# EasyEDA Pro project ProPrj_HydroNodeStation01_2026-04-19.epro, schematic Schematic1
Board Name: STM32; Create Date: 2026-04-07; Page Name: P1; Project Name: HydroNodeStation01; Schematic Name: Schematic1; Update Date: 2026-04-13; Company: EasyEDA.com; Page Size: A4; Version: V1.0
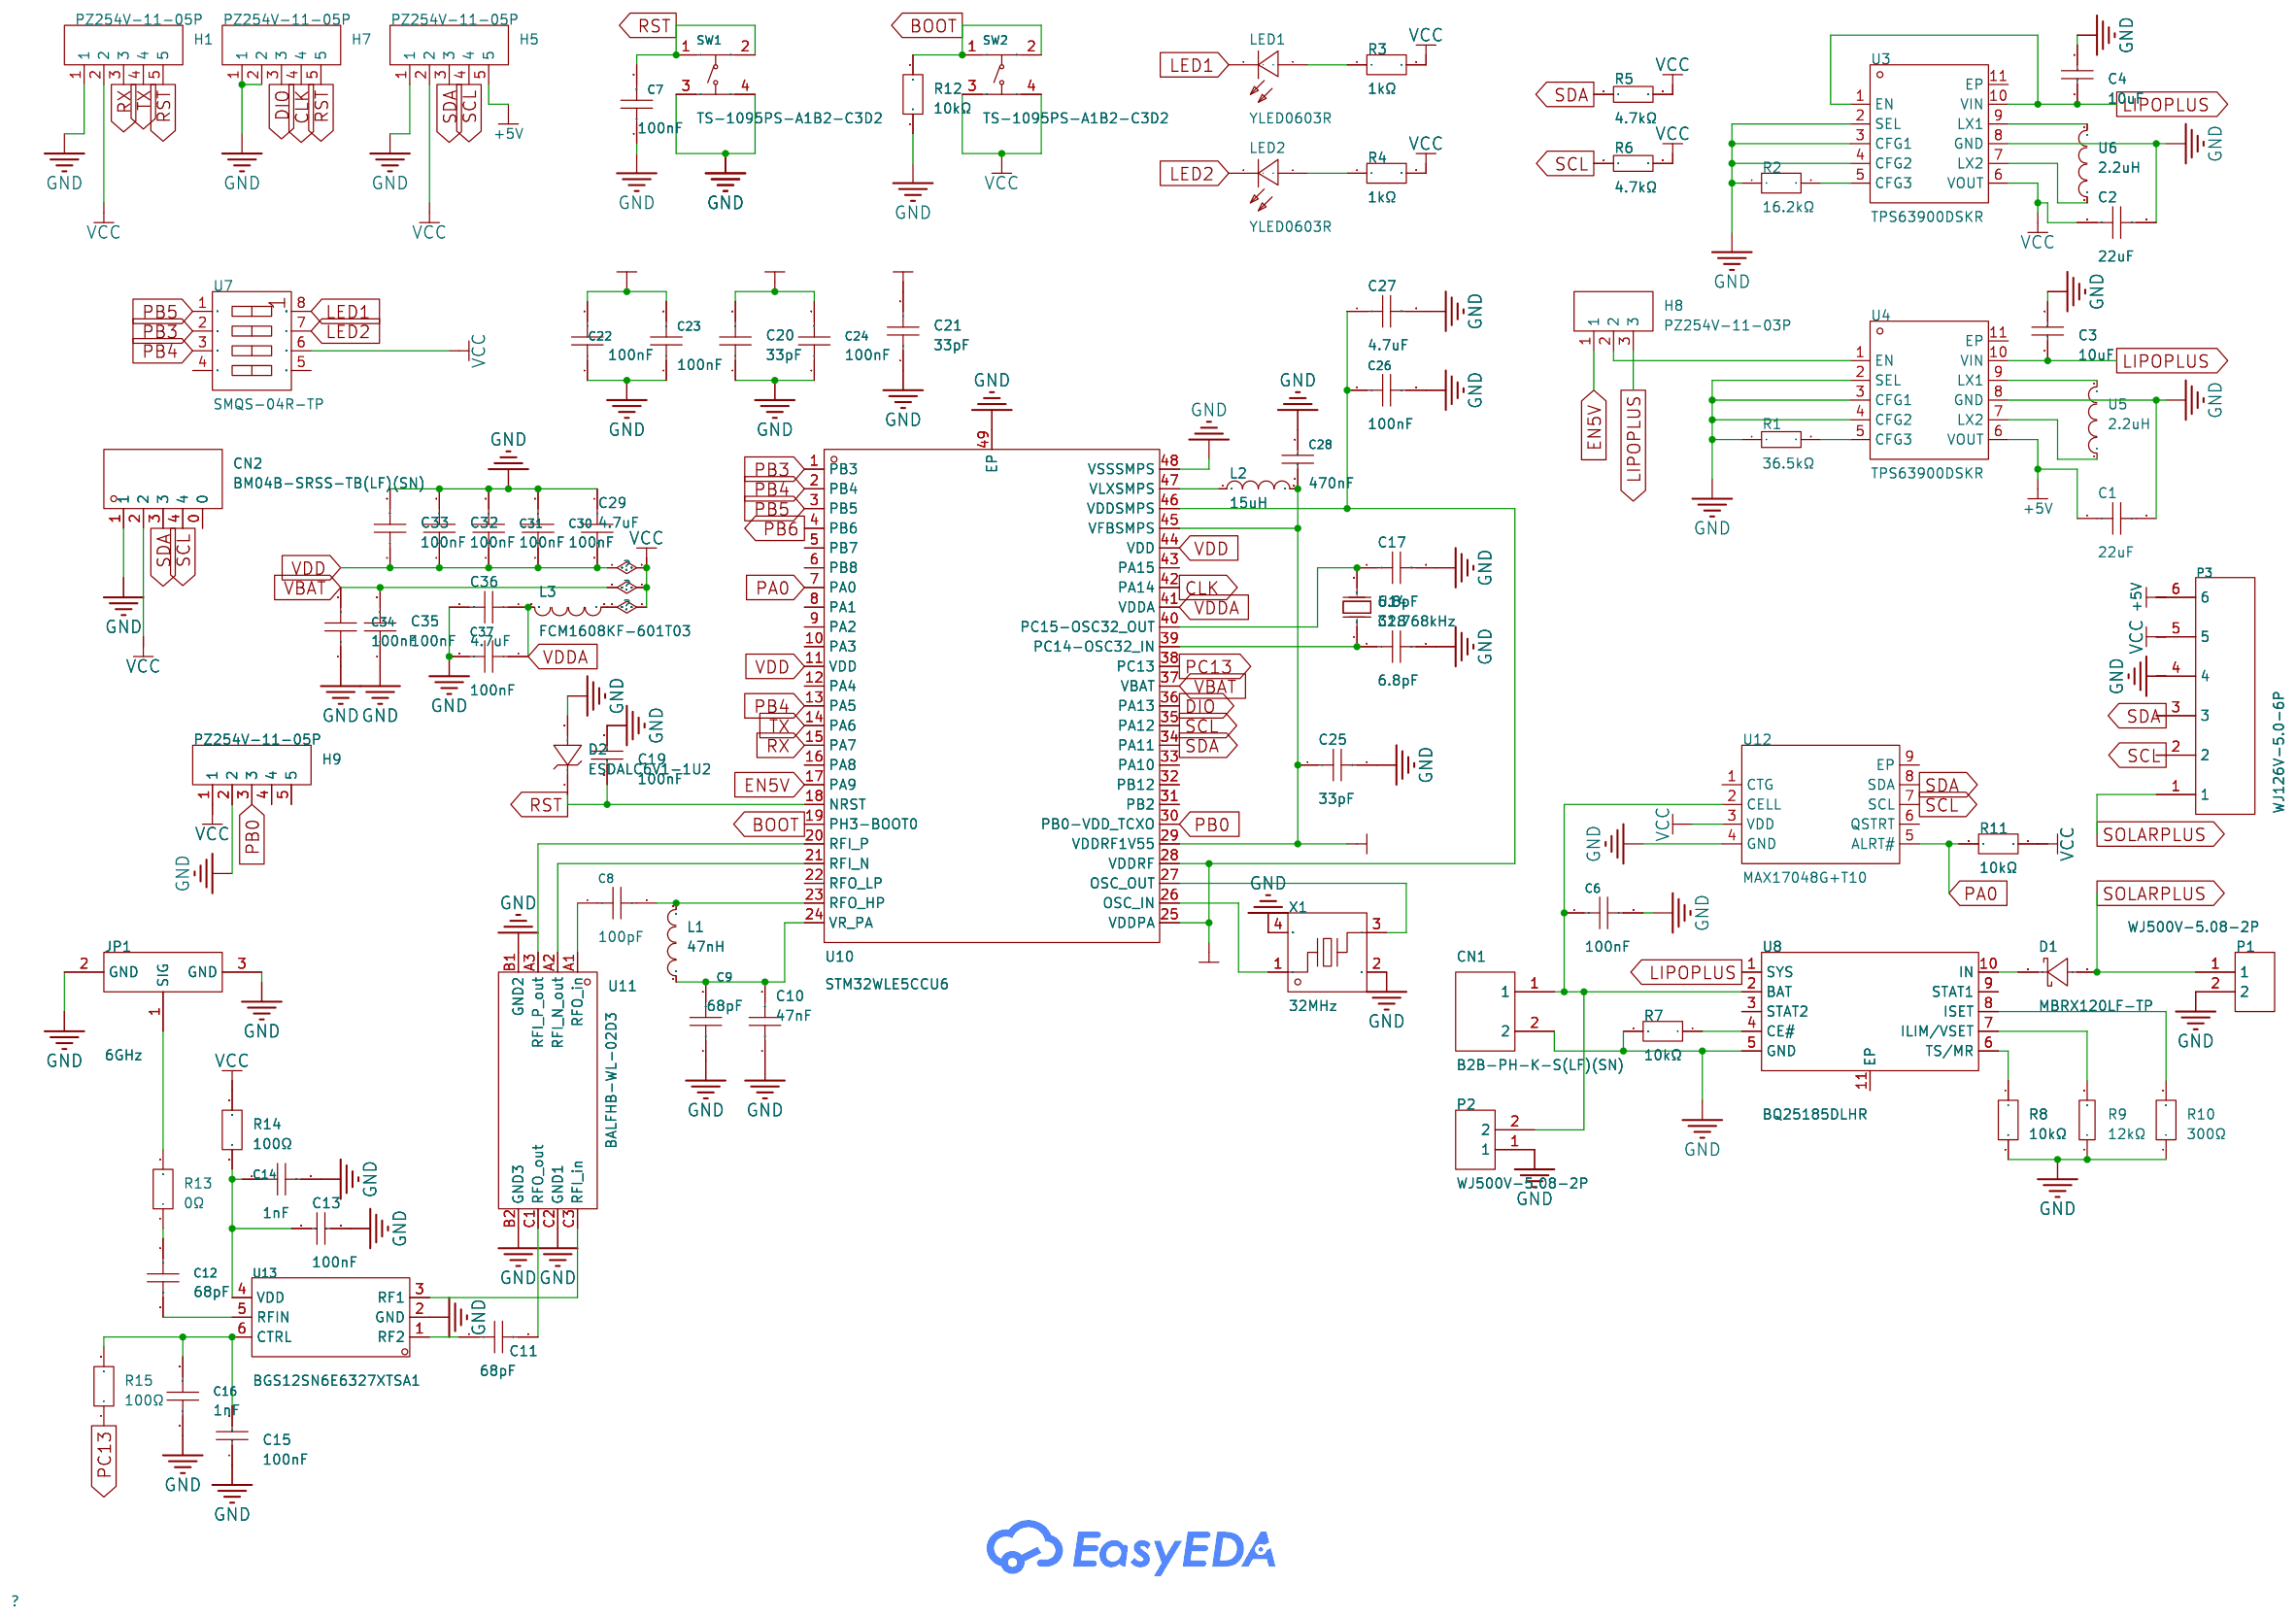
[diagram p0: schematic sheet]

## Parts
C1  22uF  [C0603]
C2  22uF  [C0603]
C3  10uF  [C0402]
C4  10uF  [C0402]
C6  100nF  [C0402]
C7  100nF  [C0402]
C8  100pF  [C0603]
C9  68pF  [C0402]
C10  47nF  [C0402]
C11  68pF  [C0201]
C12  68pF  [C0402]
C13  100nF  [C0201]
C14  1nF  [C0201]
C15  100nF  [C0201]
C16  1nF  [C0201]
C17  6.8pF  [C0402]
C18  6.8pF  [C0402]
C19  100nF  [C0201]
C20  33pF  [C0201]
C21  33pF  [C0201]
C22  100nF  [C0402]
C23  100nF  [C0402]
C24  100nF  [C0402]
C25  33pF  [C0201]
C26  100nF  [C0402]
C27  4.7uF  [C0603]
C28  470nF  [C0603]
C29  4.7uF  [C0603]
C30  100nF  [C0402]
C31  100nF  [C0402]
C32  100nF  [C0201]
C33  100nF  [C0201]
C34  100nF  [C0402]
C35  100nF  [C0201]
C36  4.7uF  [C0603]
C37  100nF  [C0402]
CN1  B2B-PH-K-S(LF)(SN)  [CONN-TH_B2B-PH-K-S]
CN2  BM04B-SRSS-TB(LF)(SN)  [CONN-SMD_BM04B-SRSS-TB]
D1  MBRX120LF-TP  [SOD-123_L2.7-W1.6-LS3.7-RD]
D2  ESDALC6V1-1U2  [DFN0603-D_L0.6-W0.3-P0.34-RD]
H1  PZ254V-11-05P  [HDR-TH_5P-P2.54-V-M]
H5  PZ254V-11-05P  [HDR-TH_5P-P2.54-V-M]
H7  PZ254V-11-05P  [HDR-TH_5P-P2.54-V-M]
H8  PZ254V-11-03P  [HDR-TH_3P-P2.54-V-M_PZ254V-11-03P]
H9  PZ254V-11-05P  [HDR-TH_5P-P2.54-V-M]
JP1  6GHz  [RF-SMD_FRF05002-JSS103M]
L1  47nH  [L0402]
L2  15uH  [L0805]
L3  FCM1608KF-601T03  [L0603]
LED1  YLED0603R  [LED0603-FD]
LED2  YLED0603R  [LED0603-FD]
P1  WJ500V-5.08-2P  [CONN-TH_2P-P5.00_WJ500V-5.08-2P]
P2  WJ500V-5.08-2P  [CONN-TH_2P-P5.00_WJ500V-5.08-2P]
P3  WJ126V-5.0-6P  [CONN-TH_6P-P5.00_WJ126V-5.0-6P]
R1  36.5kΩ  [R0402]
R2  16.2kΩ  [R0402]
R3  1kΩ  [R0402]
R4  1kΩ  [R0402]
R5  4.7kΩ  [R0603]
R6  4.7kΩ  [R0603]
R7  10kΩ  [R0805]
R8  10kΩ  [R0805]
R9  12kΩ  [R0402]
R10  300Ω  [R0603]
R11  10kΩ  [R0805]
R12  10kΩ  [R0805]
R13  0Ω  [R0201]
R14  100Ω  [R0201]
R15  100Ω  [R0201]
SW1  TS-1095PS-A1B2-C3D2  [KEY-SMD_4P-L6.0-W6.0-P3.90-LS9.0]
SW2  TS-1095PS-A1B2-C3D2  [KEY-SMD_4P-L6.0-W6.0-P3.90-LS9.0]
U3  TPS63900DSKR  [WSON-10_L2.5-W2.5-W0.50-TL-EP]
U4  TPS63900DSKR  [WSON-10_L2.5-W2.5-W0.50-TL-EP]
U5  2.2uH  [IND-SMD_L3.0-W3.0_LVF303012-4R7M-N]
U6  2.2uH  [IND-SMD_L3.0-W3.0_LVF303012-4R7M-N]
U7  SMQS-04R-TP  [SW-TH_8P-P2.54_SMQS-04R-TP]
U8  BQ25185DLHR  [WSON-10_L2.2-W2.0-P0.40-BL-EP_TI_DLH0010A]
U10  STM32WLE5CCU6  [UFQFPN-48_L7.0-W7.0-P0.50-BL-EP5.6]
U11  BALFHB-WL-02D3  [CSPG-8_L2.1-W1.8_BALFHB-WL-03D3]
U12  MAX17048G+T10  [TDFN-8_L2.0-W2.0-P0.50-BL-EP1.2]
U13  BGS12SN6E6327XTSA1  [TSNP-6_L1.1-W0.7-P0.40-BL]
U14  32.768kHz  [CRYSTAL-SMD_L2.0-W1.2]
X1  32MHz  [CRYSTAL-SMD_4P-L2.0-W1.6-BL]

## Library data of the parts
C1 C2 = CL10A226MQ8NRNC: Capacitance:22uF Tolerance:±20% Tolerance:±20% Voltage Rating:6.3V Temperature Coefficient:X5R; LCSC Part Name: 22uF ±20% 6.3V; Supplier Part: C59461; Manufacturer: SAMSUNG(三星); Supplier Footprint: 0603; JLCPCB Part Class: Basic Part; Datasheet: https://item.szlcsc.com/datasheet/CL10A226MQ8NRNC/60514.html; Supplier: LCSC; Tolerance: ±20%; Voltage Rating: 6.3V; Temperature Coefficient: X5R
C3 C4 = CL05A106MQ5NUNC: Capacitance:10uF Tolerance:±20% Tolerance:±20% Voltage Rating:6.3V Temperature Coefficient:X5R; LCSC Part Name: 10uF ±20% 6.3V; Supplier Part: C15525; Manufacturer: SAMSUNG(三星); Supplier Footprint: 0402; JLCPCB Part Class: Basic Part; Datasheet: https://item.szlcsc.com/datasheet/CL05A106MQ5NUNC/16204.html; Supplier: LCSC; Tolerance: ±20%; Voltage Rating: 6.3V; Temperature Coefficient: X5R
C6 C7 C22-C24 C26 C30 C31 C34 C37 = CC0402KRX7R7BB104: Capacitance: Tolerance:±10% Tolerance:±10% Voltage Rated: Temperature Coefficient:; LCSC Part Name: 100nF ±10% 16V; Supplier Part: C60474; Manufacturer: YAGEO(国巨); Supplier Footprint: 0402; JLCPCB Part Class: Extended Part; Datasheet: https://atta.szlcsc.com/upload/public/pdf/source/20211223/9278FD768280B81DDBEF48FA36411A03.pdf; Supplier: LCSC; Tolerance: ±10%
C8 = CC0603JRNPO9BN101: Capacitance:100pF Tolerance:±5% Tolerance:±5% Voltage Rating:50V Temperature Coefficient:NP0; LCSC Part Name: 100pF ±5% 50V; Supplier Part: C14665; Manufacturer: YAGEO(国巨); Supplier Footprint: 0603; JLCPCB Part Class: Extended Part; Datasheet: https://item.szlcsc.com/datasheet/CC0603JRNPO9BN101/15333.html; Supplier: LCSC; Tolerance: ±5%; Voltage Rating: 50V; Temperature Coefficient: NP0
C9 C12 = GCM1555C1H680JA16D: Capacitance: Tolerance:±5% Tolerance:±5% Voltage Rated: Temperature Coefficient:; LCSC Part Name: 68pF ±5% 50V; Supplier Part: C161156; Manufacturer: muRata(村田); Supplier Footprint: 0402; JLCPCB Part Class: Extended Part; Datasheet: https://atta.szlcsc.com/upload/public/pdf/source/20180821/C161156_ED77A7E61D0821D6CA5DF315C8E9CFE5.pdf; Supplier: LCSC; Tolerance: ±5%
C10 = GCM155R71E473KA55D: Capacitance:47nF Tolerance:±10% Tolerance:±10% Voltage Rating:25V Temperature Coefficient:X7R; LCSC Part Name: 47nF ±10% 25V; Supplier Part: C126529; Manufacturer: muRata(村田); Supplier Footprint: 0402; JLCPCB Part Class: Extended Part; Datasheet: https://item.szlcsc.com/datasheet/GCM155R71E473KA55D/137809.html; Supplier: LCSC; Tolerance: ±10%; Voltage Rating: 25V; Temperature Coefficient: X7R
C11 = GRM0335C1H680JA01D: Capacitance:68pF Tolerance:±5% Tolerance:±5% Voltage Rating:50V Temperature Coefficient:C0G; LCSC Part Name: 68pF ±5% 50V; Supplier Part: C88914; Manufacturer: muRata(村田); Supplier Footprint: 0201; JLCPCB Part Class: Extended Part; Datasheet: https://item.szlcsc.com/datasheet/GRM0335C1H680JA01D/90094.html; Supplier: LCSC; Tolerance: ±5%; Voltage Rating: 50V; Temperature Coefficient: C0G
C13 C15 C19 = GRM033R61A104KE15D: Capacitance: Tolerance:±10% Tolerance:±10% Voltage Rated: Temperature Coefficient:; LCSC Part Name: 100nF ±10% 10V; Supplier Part: C76934; Manufacturer: muRata(村田); Supplier Footprint: 0201; JLCPCB Part Class: Extended Part; Datasheet: https://atta.szlcsc.com/upload/public/pdf/source/20180307/C76934_15204090982891407723.pdf; Supplier: LCSC; Tolerance: ±10%
C14 C16 = GRM033R71H102KA12D: Capacitance:1nF Tolerance:±10% Tolerance:±10% Voltage Rating:50V Temperature Coefficient:X7R; LCSC Part Name: 1nF ±10% 50V; Supplier Part: C85934; Manufacturer: muRata(村田); Supplier Footprint: 0201; JLCPCB Part Class: Extended Part; Datasheet: https://item.szlcsc.com/datasheet/GRM033R71H102KA12D/87110.html; Supplier: LCSC; Tolerance: ±10%; Voltage Rating: 50V; Temperature Coefficient: X7R
C17 C18 = GJM1555C1H6R8BB01D: Capacitance:6.8pF Voltage Rating:50V Temperature Coefficient:C0G; LCSC Part Name: ±0.1pF 6.8pF 50V; Supplier Part: C88896; Manufacturer: muRata(村田); Supplier Footprint: 0402; JLCPCB Part Class: Extended Part; Datasheet: https://item.szlcsc.com/datasheet/GJM1555C1H6R8BB01D/90076.html; Supplier: LCSC; Voltage Rating: 50V; Temperature Coefficient: C0G
C20 C21 C25 = GJM0335C1E330GB01D: Capacitance:33pF Tolerance:±2% Tolerance:±2% Voltage Rating:25V Temperature Coefficient:C0G; LCSC Part Name: 33pF ±2% 25V; Supplier Part: C2896796; Manufacturer: muRata(村田); Supplier Footprint: 0201; JLCPCB Part Class: Extended Part; Datasheet: https://item.szlcsc.com/datasheet/GJM0335C1E330GB01D/3140038.html; Supplier: LCSC; Tolerance: ±2%; Voltage Rating: 25V; Temperature Coefficient: C0G
C27 C29 C36 = CC0603KRX5R7BB475: Capacitance: Tolerance:±10% Tolerance:±10% Voltage Rated: Temperature Coefficient:; LCSC Part Name: 4.7uF ±10% 16V; Supplier Part: C277476; Manufacturer: YAGEO(国巨); Supplier Footprint: 0603; JLCPCB Part Class: Extended Part; Datasheet: https://atta.szlcsc.com/upload/public/pdf/source/20240708/74D7CC2672B7CD71C30ED4CACAE97037.pdf; Supplier: LCSC; Tolerance: ±10%
C28 = CC0603KRX5R8BB474: Capacitance:470nF Tolerance:±10% Tolerance:±10% Voltage Rating:25V Temperature Coefficient:X5R; LCSC Part Name: 470nF ±10% 25V; Supplier Part: C106850; Manufacturer: YAGEO(国巨); Supplier Footprint: 0603; JLCPCB Part Class: Extended Part; Datasheet: https://item.szlcsc.com/datasheet/CC0603KRX5R8BB474/108066.html; Supplier: LCSC; Tolerance: ±10%; Voltage Rating: 25V; Temperature Coefficient: X5R
C32 C33 C35 = C0603X5R1C104KT00NE: Capacitance:100nF Tolerance:±10% Tolerance:±10% Voltage Rating:16V Temperature Coefficient:X5R; LCSC Part Name: 100nF ±10% 16V; Supplier Part: C694145; Manufacturer: TDK; Supplier Footprint: 0201; JLCPCB Part Class: Extended Part; Datasheet: https://item.szlcsc.com/datasheet/C0603X5R1C104KT00NE/726963.html; Supplier: LCSC; Tolerance: ±10%; Voltage Rating: 16V; Temperature Coefficient: X5R
CN1 = B2B-PH-K-S(LF)(SN): Pins Structure:1x2P Pitch:2mm Mounting Type:Through Hole Reference Series:PH Number of Pins:2P Number of Rows:1 Number of PINs Per Row:2 Row Spacing:- Current Rating:2A Contact Material:Brass Contact Plating:Tin Operating Temperature:-25℃~+85℃ Operating T; LCSC Part Name: 1x2P 间距:2mm 直插 系列:PH; Supplier Part: C131337; Manufacturer: JST; Supplier Footprint: 插件,P=2mm; JLCPCB Part Class: Extended Part; Datasheet: https://item.szlcsc.com/datasheet/B2B-PH-K-S(LF)(SN)/142630.html; Supplier: LCSC; Pins Structure: 1x2P; Pitch: 2mm; Mounting Type: Through Hole; Reference Series: PH; Number of Pins: 2P; Number of Rows: 1; Number of PINs Per Row: 2; Current Rating: 2A; Contact Material: Brass; Contact Plating: Tin; Operating Temperature: -25℃~+85℃; Voltage Rating: 100V; Plastic Material: PA66; Flame Retardant Rating: UL94V-0; Supplementary Features: K Pin; Color: White; Z-Height of the Board: 6mm; X-Length of Bottom Edge on Board (Spacing Line): 5.9mm; Y-Width of Bottom Edge on Board: 4.5mm
CN2 = BM04B-SRSS-TB(LF)(SN): Pins Structure:1x4P Pitch:1mm Mounting Type:Surface Mount,Vertical Reference Series:SR Number of Pins:4P Number of Rows:1 Number of PINs Per Row:4 Row Spacing:- Current Rating:1A Contact Material:Copper Alloy Contact Plating:Tin Operating Temperature:-25℃; LCSC Part Name: 1x4P 间距:1mm 立贴 系列:SR; Supplier Part: C160390; Manufacturer: JST; Supplier Footprint: SMD,P=1mm; JLCPCB Part Class: Extended Part; Datasheet: https://item.szlcsc.com/datasheet/BM04B-SRSS-TB(LF)(SN)/171770.html; Supplier: LCSC; Pins Structure: 1x4P; Pitch: 1mm; Mounting Type: Surface Mount,Vertical; Reference Series: SR; Number of Pins: 4P; Number of Rows: 1; Number of PINs Per Row: 4; Current Rating: 1A; Contact Material: Copper Alloy; Contact Plating: Tin; Operating Temperature: -25℃~+85℃; Voltage Rating: 50V; Plastic Material: PA; Flame Retardant Rating: UL94V-0; Supplementary Features: Auxiliary Solder Pin; Color: White; Z-Height of the Board: 4.25mm; X-Length of Bottom Edge on Board (Spacing Line): 6mm; Y-Width of Bottom Edge on Board: 3.6mm
D1 = MBRX120LF-TP: Diode Configuration:- Voltage - Forward(Vf@If):320mV@1A Voltage - DC Reverse(Vr):20V Current - Rectified:1A Reverse Leakage Current (Ir):260uA@5V Operating Junction Temperature Range:-65℃~+125℃ Operating Junction Temperature Range:-65℃~+125℃ Non-Repetitiv; LCSC Part Name: 电压:20V 电流:1A; Supplier Part: C668956; Manufacturer: MCC(美微科); Supplier Footprint: SOD-123; JLCPCB Part Class: Extended Part; Datasheet: https://item.szlcsc.com/datasheet/MBRX120LF-TP/699015.html; Supplier: LCSC; Voltage - Forward(Vf@If): 320mV@1A; Voltage - DC Reverse(Vr): 20V; Current - Rectified: 1A; Reverse Leakage Current (Ir): 260uA@5V; Operating Junction Temperature Range: -65℃~+125℃; Non-Repetitive Peak Forward Surge Current: 12A
D2 = ESDALC6V1-1U2: Reverse Stand-Off Voltage (Vrwm):3V Maximum Clamping Voltage:6.1V Peak Pulse Power Dissipation (Ppp):20W Breakdown Voltage:6.1V Number of Lines:Single channel Operating Temperature:-40℃~+125℃@(Tj) Operating Temperature:-40℃~+125℃@(Tj) Type:ESD; Supplier Part: C1974498; Manufacturer: ST(意法半导体); Supplier Footprint: 0201; JLCPCB Part Class: Extended Part; Datasheet: https://atta.szlcsc.com/upload/public/pdf/source/20210702/A9E16A8F1942D08FD4D8010EFF157F4D.pdf; Supplier: LCSC; Reverse Stand-Off Voltage (Vrwm): 3V; Maximum Clamping Voltage: 6.1V; Peak Pulse Power Dissipation (Ppp): 20W; Breakdown Voltage: 6.1V; Number of Lines: Single channel; Operating Temperature: -40℃~+125℃@(Tj); Type: ESD
H1 H5 H7 H9 = PZ254V-11-05P: Pin Structure:1x5P Pitch:2.54mm Row Spacing:- Circluar Pins/Square Pins:Pin Header Mounting Type:Through Hole Number of Rows:1 Number of Pins:5P Current Rating:3A Voltage Rating (Max):250V Length of Mating Pin:6mm Insulation Height:2.5mm Length of End Con; LCSC Part Name: 1x5P 间距:2.54mm 方针 直插; Supplier Part: C492404; Manufacturer: XFCN(兴飞); Supplier Footprint: 插件,P=2.54mm; JLCPCB Part Class: Extended Part; Datasheet: https://item.szlcsc.com/datasheet/PZ254V-11-05P/502960.html; Supplier: LCSC; Pin Structure: 1x5P; Pitch: 2.54mm; Circluar Pins/Square Pins: Pin Header; Mounting Type: Through Hole; Number of Rows: 1; Number of Pins: 5P; Current Rating: 3A; Voltage Rating (Max): 250V; Length of Mating Pin: 6mm; Insulation Height: 2.5mm; Length of End Connection Pin: 3mm; Contact Material: Brass; Operating Temperature: -40℃~+105℃; Color: Black
H8 = PZ254V-11-03P: Pin Structure:1x3P Pitch:2.54mm Row Spacing:- Circluar Pins/Square Pins:Pin Header Mounting Type:Through Hole Number of Rows:1 Number of Pins:3P Current Rating:3A Voltage Rating (Max):250V Length of Mating Pin:6mm Insulation Height:2.5mm Length of End Con; LCSC Part Name: 1x3P 间距:2.54mm 方针 直插; Supplier Part: C2937625; Manufacturer: XFCN(兴飞); Supplier Footprint: 插件,P=2.54mm; JLCPCB Part Class: Extended Part; Datasheet: https://item.szlcsc.com/datasheet/PZ254V-11-03P/3293280.html; Supplier: LCSC; Pin Structure: 1x3P; Pitch: 2.54mm; Circluar Pins/Square Pins: Pin Header; Mounting Type: Through Hole; Number of Rows: 1; Number of Pins: 3P; Current Rating: 3A; Voltage Rating (Max): 250V; Length of Mating Pin: 6mm; Insulation Height: 2.5mm; Length of End Connection Pin: 3mm; Operating Temperature: -40℃~+105℃; Color: Black
JP1 = U.FL-R-SMT-1(80)_C88374: Connector Type:Board Side Interface:Male Pin Number of Ports:1 Interface Diameter:2mm Interface Length/Height:1.25mm Frequency:6GHz RF Series:IPEX Impedance:50Ω Style:- Operating Temperature Range:-40℃~+90℃ Operating Temperature Range:-40℃~+90℃; LCSC Part Name: IPEX 内针; Supplier Part: C88374; Manufacturer: HRS(广濑); Manufacturer Part: U.FL-R-SMT-1(80); Supplier Footprint: SMD; JLCPCB Part Class: Extended Part; Datasheet: https://item.szlcsc.com/datasheet/U.FL-R-SMT-1(80)/89553.html; Supplier: LCSC; Connector Type: Board Side; Interface: Male Pin; Number of Ports: 1; Interface Diameter: 2mm; Interface Length/Height: 1.25mm; RF Series: IPEX; Impedance: 50Ω; Operating Temperature Range: -40℃~+90℃
L1 = LQW15AN47NG00D: Inductance:47nH Tolerance:±2% Tolerance:±2% Current Rating:210mA Current - Saturation(Isat):- DC Resistance(DCR):1.08Ω Ratings:-; LCSC Part Name: 47nH ±2%; Supplier Part: C22334; Manufacturer: muRata(村田); Supplier Footprint: 0402; JLCPCB Part Class: Extended Part; Datasheet: https://item.szlcsc.com/datasheet/LQW15AN47NG00D/23059.html; Supplier: LCSC; Tolerance: ±2%; Current Rating: 210mA; DC Resistance(DCR): 1.08Ω
L2 = MLZ2012M150WTD25: Inductance: Tolerance:±20% Tolerance:±20% Rated Current: Saturation Current (Isat):120mA DC Resistance (DCR): Q @ Freq:- Frequency - Self Resonant:- Ratings:AEC-Q200 Type:叠层电感; LCSC Part Name: 15uH ±20% 120mA; Supplier Part: C404760; Manufacturer: TDK; Supplier Footprint: 0805; JLCPCB Part Class: Extended Part; Datasheet: https://atta.szlcsc.com/upload/public/pdf/source/20200715/C404746_F5DC11543445F89E01786DA40283D148.pdf; Supplier: LCSC; Tolerance: ±20%; Saturation Current (Isat): 120mA; Ratings: AEC-Q200; Type: 叠层电感
L3 = FCM1608KF-601T03: Impedance @ Frequency:600Ω@100MHz Tolerance:±25% Tolerance:±25% DC Resistance(DCR):500mΩ Current Rating:350mA Number of Circuits:1; LCSC Part Name: 单路 0603磁珠 阻抗600Ω@100MHz; Supplier Part: C141723; Manufacturer: TAI-TECH(台庆); Supplier Footprint: 0603; JLCPCB Part Class: Extended Part; Datasheet: https://item.szlcsc.com/datasheet/FCM1608KF-601T03/153054.html; Supplier: LCSC; Impedance @ Frequency: 600Ω@100MHz; Tolerance: ±25%; DC Resistance(DCR): 500mΩ; Current Rating: 350mA; Number of Circuits: 1
LED1 LED2 = YLED0603R: Lamp Holder Type:-；- Illumination Color:Red Voltage - Forward(Vf):1.8V~2.4V Voltage - Forward(Vf):1.8V~2.4V Power(Watts):- Forward Current:25mA Wavelength - Dominant:620nm~625nm Wavelength - Dominant:620nm~625nm Peak Wavelength:- Diode Configuration:Discr; LCSC Part Name: 红色 独立二极管; Supplier Part: C19171390; Manufacturer: YONGYUTAI(永裕泰); Supplier Footprint: 0603; JLCPCB Part Class: Extended Part; Datasheet: https://item.szlcsc.com/datasheet/YLED0603R/20382441.html; Supplier: LCSC; Lamp Holder Type: -；-; Illumination Color: Red; Voltage - Forward(Vf): 1.8V~2.4V; Forward Current: 25mA; Wavelength - Dominant: 620nm~625nm; Diode Configuration: Discrete Diode; Luminous Intensity: 120mcd; Viewing Angle: 120°; Operating Temperature: -40℃~+85℃
P1 P2 = WJ500V-5.08-2P: Structure:1x2P Pitch:5.08mm Color:Green Mounting Style:Direct Insert Current Rating (Max):18A Voltage Rating (Max):250V Number of Pins:2P Number of Rows:1 Wire Gauge - AWG:14~30 Wire Gauge - AWG:14~30 Wire Gauge - mm2:2.5 Wire Gauge - mm2:2.5 Number of PI; LCSC Part Name: 1x2P 5.08mm 直插 排数:1 每排P数:2; Supplier Part: C8465; Manufacturer: KANGNEX(康奈克斯电气); Supplier Footprint: 插件,P=5.08mm; JLCPCB Part Class: Extended Part; Datasheet: https://atta.szlcsc.com/upload/public/pdf/source/20191225/C8465_02D34CE5B5B4A53DF5891601D97FA9F4.pdf; Supplier: LCSC; Structure: 1x2P; Pitch: 5.08mm; Color: Green; Mounting Style: Direct Insert; Current Rating (Max): 18A; Voltage Rating (Max): 250V; Number of Pins: 2P; Number of Rows: 1; Wire Gauge - AWG: 14~30; Wire Gauge - mm2: 2.5; Number of PINs Per Row: 2; Operating Temperature Range: -40℃~+105℃; Screw Specification: M2.5
P3 = WJ126V-5.0-6P: Structure:1x6P Pitch:5mm Color:Green Mounting Style:Straight Current Rating (Max):18A Voltage Rating (Max):250V Number of Pins:6P Number of Rows:1 Wire Gauge - AWG:14~26 Wire Gauge - AWG:14~26 Wire Gauge - mm2:2.5 Wire Gauge - mm2:2.5 Number of PINs Per R; LCSC Part Name: 5mm 1x6P 排数:1 每排P数:6 直插; Supplier Part: C8379; Manufacturer: KANGNEX(康奈克斯电气); Supplier Footprint: 插件,P=5mm; JLCPCB Part Class: Extended Part; Datasheet: https://atta.szlcsc.com/upload/public/pdf/source/20191225/C8379_3D37D98EF6F0ECCD8D2EB72C93E46299.pdf; Supplier: LCSC; Structure: 1x6P; Pitch: 5mm; Color: Green; Mounting Style: Straight; Current Rating (Max): 18A; Voltage Rating (Max): 250V; Number of Pins: 6P; Number of Rows: 1; Wire Gauge - AWG: 14~26; Wire Gauge - mm2: 2.5; Number of PINs Per Row: 6; Operating Temperature Range: -40℃~+105℃
R1 = 0402WGF3652TCE: Type:Thick Film Resistor Resistance:36.5kΩ Tolerance:±1% Tolerance:±1% Power(Watts):62.5mW Voltage-Supply(Max):50V Temperature Coefficient:±100ppm/℃ Temperature Coefficient:±100ppm/℃ Operating Temperature:-55℃~+155℃ Operating Temperature:-55℃~+155℃; LCSC Part Name: 36.5kΩ ±1% 62.5mW 厚膜电阻; Supplier Part: C25887; Manufacturer: UNI-ROYAL(厚声); Supplier Footprint: 0402; JLCPCB Part Class: Extended Part; Datasheet: https://item.szlcsc.com/datasheet/0402WGF3652TCE/26630.html; Supplier: LCSC; Type: Thick Film Resistor; Tolerance: ±1%; Power(Watts): 62.5mW; Voltage-Supply(Max): 50V; Temperature Coefficient: ±100ppm/℃; Operating Temperature: -55℃~+155℃
R2 = FRC0402F1622TS: Type:Thick Film Resistor Resistance:16.2kΩ Tolerance:±1% Tolerance:±1% Power(Watts):62.5mW Voltage-Supply(Max):50V Temperature Coefficient:±100ppm/℃ Temperature Coefficient:±100ppm/℃ Operating Temperature:-55℃~+155℃ Operating Temperature:-55℃~+155℃; LCSC Part Name: 厚膜电阻 0402 16.2KΩ ±1% 62.5mW; Supplier Part: C49196904; Manufacturer: FOJAN(富捷); Supplier Footprint: 0402; JLCPCB Part Class: Extended Part; Datasheet: https://item.szlcsc.com/datasheet/FRC0402F1622TS/51599152.html; Supplier: LCSC; Type: Thick Film Resistor; Tolerance: ±1%; Power(Watts): 62.5mW; Voltage-Supply(Max): 50V; Temperature Coefficient: ±100ppm/℃; Operating Temperature: -55℃~+155℃
R3 R4 = FRC0402J102 TS: Type:Thick Film Resistor Resistance:1kΩ Tolerance:±5% Tolerance:±5% Power(Watts):62.5mW Voltage-Supply(Max):50V Temperature Coefficient:±100ppm/℃ Temperature Coefficient:±100ppm/℃ Operating Temperature:-55℃~+155℃ Operating Temperature:-55℃~+155℃; LCSC Part Name: 1kΩ ±5% 62.5mW 厚膜电阻; Supplier Part: C2906899; Manufacturer: FOJAN(富捷); Supplier Footprint: 0402; JLCPCB Part Class: Extended Part; Supplier: LCSC; Type: Thick Film Resistor; Tolerance: ±5%; Power(Watts): 62.5mW; Voltage-Supply(Max): 50V; Temperature Coefficient: ±100ppm/℃; Operating Temperature: -55℃~+155℃
R5 R6 = 0603WAF4701T5E: Type:Thick Film Resistor Resistance:4.7kΩ Tolerance:±1% Tolerance:±1% Power(Watts):100mW Voltage-Supply(Max):75V Temperature Coefficient:±100ppm/℃ Temperature Coefficient:±100ppm/℃ Operating Temperature:-55℃~+155℃ Operating Temperature:-55℃~+155℃; LCSC Part Name: 4.7kΩ ±1% 100mW 厚膜电阻; Supplier Part: C23162; Manufacturer: UNI-ROYAL(厚声); Supplier Footprint: 0603; JLCPCB Part Class: Basic Part; Datasheet: https://item.szlcsc.com/datasheet/0603WAF4701T5E/23889.html; Supplier: LCSC; Type: Thick Film Resistor; Tolerance: ±1%; Power(Watts): 100mW; Voltage-Supply(Max): 75V; Temperature Coefficient: ±100ppm/℃; Operating Temperature: -55℃~+155℃
R7 R8 R11 R12 = FRC0805J103TS: Type:Thick Film Resistor Resistance:10kΩ Tolerance:±5% Tolerance:±5% Power(Watts):125mW Voltage-Supply(Max):150V Temperature Coefficient:±100ppm/℃ Temperature Coefficient:±100ppm/℃ Operating Temperature:-55℃~+155℃ Operating Temperature:-55℃~+155℃; LCSC Part Name: 10kΩ ±5% 125mW 厚膜电阻; Supplier Part: C2930231; Manufacturer: FOJAN(富捷); Supplier Footprint: 0805; JLCPCB Part Class: Extended Part; Supplier: LCSC; Type: Thick Film Resistor; Tolerance: ±5%; Power(Watts): 125mW; Voltage-Supply(Max): 150V; Temperature Coefficient: ±100ppm/℃; Operating Temperature: -55℃~+155℃
R9 = 0402WGF1202TCE: Type:Thick Film Resistor Resistance:12kΩ Tolerance:±1% Tolerance:±1% Power(Watts):62.5mW Voltage-Supply(Max):50V Temperature Coefficient:±100ppm/℃ Temperature Coefficient:±100ppm/℃ Operating Temperature:-55℃~+155℃ Operating Temperature:-55℃~+155℃; LCSC Part Name: 12kΩ ±1% 62.5mW 厚膜电阻; Supplier Part: C25752; Manufacturer: UNI-ROYAL(厚声); Supplier Footprint: 0402; JLCPCB Part Class: Basic Part; Datasheet: https://item.szlcsc.com/datasheet/0402WGF1202TCE/26495.html; Supplier: LCSC; Type: Thick Film Resistor; Tolerance: ±1%; Power(Watts): 62.5mW; Voltage-Supply(Max): 50V; Temperature Coefficient: ±100ppm/℃; Operating Temperature: -55℃~+155℃
R10 = FRC0603J301 TS: Type:Thick Film Resistor Resistance:300Ω Tolerance:±5% Tolerance:±5% Power(Watts):100mW Voltage-Supply(Max):75V Temperature Coefficient:±100ppm/℃ Temperature Coefficient:±100ppm/℃ Operating Temperature:-55℃~+155℃ Operating Temperature:-55℃~+155℃; LCSC Part Name: 300Ω ±5% 100mW 厚膜电阻; Supplier Part: C2907148; Manufacturer: FOJAN(富捷); Supplier Footprint: 0603; JLCPCB Part Class: Extended Part; Supplier: LCSC; Type: Thick Film Resistor; Tolerance: ±5%; Power(Watts): 100mW; Voltage-Supply(Max): 75V; Temperature Coefficient: ±100ppm/℃; Operating Temperature: -55℃~+155℃
R13 = CRCW02010000Z0ED: Type:Thick Film Resistors Resistance: Power(Watts): Overload Voltage (Max): Operating Temperature Range:-55℃~+155℃ Operating Temperature Range:-55℃~+155℃; LCSC Part Name: 厚膜电阻 0Ω 50mW; Supplier Part: C844709; Manufacturer: VISHAY(威世); Supplier Footprint: 0201; JLCPCB Part Class: Extended Part; Datasheet: https://atta.szlcsc.com/upload/public/pdf/source/20201126/C844096_7C308AB530155FB69DE888E53342C8A4.pdf; Supplier: LCSC; Type: Thick Film Resistors; Operating Temperature Range: -55℃~+155℃
R14 R15 = CRCW0201100RFNED: Type:Thick Film Resistor Resistance:100Ω Tolerance:±1% Tolerance:±1% Power(Watts):50mW Voltage-Supply(Max):30V Temperature Coefficient:±200ppm/℃ Temperature Coefficient:±200ppm/℃ Operating Temperature:-55℃~+155℃ Operating Temperature:-55℃~+155℃; LCSC Part Name: 厚膜电阻 100Ω ±1% 50mW; Supplier Part: C2073844; Manufacturer: VISHAY(威世); Supplier Footprint: 0201; JLCPCB Part Class: Extended Part; Datasheet: https://item.szlcsc.com/datasheet/CRCW0201100RFNED/2165430.html; Supplier: LCSC; Type: Thick Film Resistor; Tolerance: ±1%; Power(Watts): 50mW; Voltage-Supply(Max): 30V; Temperature Coefficient: ±200ppm/℃; Operating Temperature: -55℃~+155℃
SW1 SW2 = TS-1095PS-A1B2-C3D2: Circuit:SPST Actuator Style:Round Button Operating Force:1.8N Mounting Type:Surface Mount,Vertical Length:6mm Width:6mm Switch Height:4.3mm with Bracket:Without Bracket Actuator/Cap Color:Black Termination Style:Gull Wing Life:-; LCSC Part Name: 6*6*4.3mm 立贴 轻触开关; Supplier Part: C2834918; Manufacturer: Yuandi(元迪); Supplier Footprint: SMD-4P,6x6mm; JLCPCB Part Class: Extended Part; Datasheet: https://item.szlcsc.com/datasheet/TS-1095PS-A1B2-C3D2/2997598.html; Supplier: LCSC; Circuit: SPST; Actuator Style: Round Button; Operating Force: 1.8N; Mounting Type: Surface Mount,Vertical; Length: 6mm; Width: 6mm; Switch Height: 4.3mm; with Bracket: Without Bracket; Actuator/Cap Color: Black; Termination Style: Gull Wing
U3 U4 = TPS63900DSKR: Input Voltage:1.8V~5.5V Input Voltage:1.8V~5.5V Output Current:400mA Switching Frequency:- Switching Frequency:- Operating Temperature:-40℃~+125℃@(TJ) Operating Temperature:-40℃~+125℃@(TJ) Synchronous Rectification:Yes Number of Outputs:- Topology:Step-do; LCSC Part Name: 1.8V至5.5V,75nA超低静态电流同步升降压转换器; Supplier Part: C1518762; Manufacturer: TI(德州仪器); Supplier Footprint: WSON-10-EP(2.5x2.5); JLCPCB Part Class: Extended Part; Datasheet: https://www.ti.com/cn/lit/gpn/tps63900; Supplier: LCSC; Input Voltage: 1.8V~5.5V; Output Current: 400mA; Operating Temperature: -40℃~+125℃@(TJ); Synchronous Rectification: Yes; Topology: Step-down-Boost
U5 U6 = SRN3015-2R2M: Inductance:2.2uH Tolerance:±20% Tolerance:±20% Current Rating:1.8A Current - Saturation(Isat):1.65A DC Resistance(DCR):72mΩ Type:Magnetic Shielded Inductor Ratings:-; LCSC Part Name: 2.2uH ±20% 1.65A; Supplier Part: C2041716; Manufacturer: BOURNS; Supplier Footprint: SMD,3x3mm; JLCPCB Part Class: Extended Part; Datasheet: https://item.szlcsc.com/datasheet/SRN3015-2R2M/2133279.html; Supplier: LCSC; Tolerance: ±20%; Current Rating: 1.8A; Current - Saturation(Isat): 1.65A; DC Resistance(DCR): 72mΩ; Type: Magnetic Shielded Inductor
U7 = SMQS-04R-TP: Type:Slide, Rocked Circuit:- Number of Positions:4 Termination Style:- Lead Pitch:2.54mm Current Rating:- Voltage Rating:- Operating Temperature:-40℃~+85℃ Operating Temperature:-40℃~+85℃ Operating Life:5000 Cycles Color:Red; LCSC Part Name: 间距2.54mm 平拨,凸起式4位拨码开关; Supplier Part: C5299505; Manufacturer: SM Switch; Supplier Footprint: 插件,P=2.54mm; JLCPCB Part Class: Extended Part; Datasheet: https://item.szlcsc.com/datasheet/SMQS-04R-TP/6048193.html; Supplier: LCSC; Type: Slide, Rocked; Number of Positions: 4; Lead Pitch: 2.54mm; Operating Temperature: -40℃~+85℃; Operating Life: 5000 Cycles; Color: Red
U8 = BQ25185DLHR: The Chip Type:Charging IC Voltage - Supply:3V~18V Voltage - Supply:3V~18V Charge Current - Max:1A Charging Saturation Voltage:4.4V End-Off Voltage:2.2V Type of Battery:Lithium Battery；LiFePO4 Battery Number of Cells:1 Number of Cells:1 Operating Temperatu; LCSC Part Name: 单节1A独立线性电池充电器，具备电源路径、工厂模式和电池跟踪功能; Supplier Part: C19725033; Manufacturer: TI(德州仪器); Supplier Footprint: WSON-10-EP(2.2x2); JLCPCB Part Class: Extended Part; Datasheet: https://www.ti.com.cn/cn/lit/ds/symlink/bq25185.pdf?ts=1739415017761&ref_url=https%253A%252F%252Fwww.ti.com.cn%252Fproduct%252Fcn%252FBQ25185%253FkeyMatch%253Dbq25185%2526tisearch%253Duniversal_search; Supplier: LCSC; The Chip Type: Charging IC; Voltage - Supply: 3V~18V; Charge Current - Max: 1A; Charging Saturation Voltage: 4.4V; End-Off Voltage: 2.2V; Type of Battery: Lithium Battery；LiFePO4 Battery; Number of Cells: 1; Operating Temperature: -40℃~+125℃; Battery Temperature Detection: Support; Supply Current (Iq): 4uA
U10 = STM32WLE5CCU6: LCSC Part Name: Sub-GHz 无线微控制器。Arm Cortex-M4 @48 MHz，配备 256 KB 闪存，64 KB SRAM。LoRa、(G)FSK、(G)MSK、BPSK 调制方式。AES 256位。多协议系统级芯片。; Supplier Part: C2888218; Manufacturer: ST(意法半导体); Supplier Footprint: UFQFPN-48(7x7); JLCPCB Part Class: Extended Part; Datasheet: https://item.szlcsc.com/datasheet/STM32WLE5CCU6/3107723.html; Supplier: LCSC
U11 = BALFHB-WL-02D3: Filter Type:Bandpass Absolute Bandwidth:862MHz~928MHz Absolute Bandwidth:862MHz~928MHz Impedance:50Ω Insertion Loss:0.85dB Operating Temperature:-40℃~+105℃ Operating Temperature:-40℃~+105℃; LCSC Part Name: 50 Ω标称输入/共轭匹配巴伦，适用于高功率模式下的QFN-4L STM32WL，频率范围862-928 MHz，集成谐波滤波器; Supplier Part: C5350082; Manufacturer: ST(意法半导体); Supplier Footprint: CSPG-8; JLCPCB Part Class: Extended Part; Datasheet: https://item.szlcsc.com/datasheet/BALFHB-WL-02D3/6136636.html; Supplier: LCSC; Filter Type: Bandpass; Absolute Bandwidth: 862MHz~928MHz; Impedance: 50Ω; Insertion Loss: 0.85dB; Operating Temperature: -40℃~+105℃
U12 = MAX17048G+T10: The Chip Type:Monitoring IC Voltage - Supply:2.5V~4.5V Voltage - Supply:2.5V~4.5V Charge Current - Max:- Charging Saturation Voltage:- End-Off Voltage:- Type of Battery:Lithium Battery Number of Cells:1 Number of Cells:1 Operating Temperature:-40℃~+85℃ Op; LCSC Part Name: 3uA单节/双节电池电量计，带ModelGauge算法; Supplier Part: C2682616; Manufacturer: ADI(亚德诺)/MAXIM(美信); Supplier Footprint: DFN-8-EP(2x2); JLCPCB Part Class: Extended Part; Datasheet: https://item.szlcsc.com/datasheet/MAX17048G%252BT10/2777647.html; Supplier: LCSC; The Chip Type: Monitoring IC; Voltage - Supply: 2.5V~4.5V; Type of Battery: Lithium Battery; Number of Cells: 1; Operating Temperature: -40℃~+85℃; Battery Temperature Detection: Not supported; 0V Battery Charge: Not supported; Supply Current (Iq): 3uA; Interface: I2C
U13 = BGS12SN6E6327XTSA1: isolation:47dB Insertion loss:0.9dB Frequency range:50MHz~6GHz Frequency range:50MHz~6GHz Voltage - Supply:1.8V~3.5V Voltage - Supply:1.8V~3.5V operating temperature:-40℃~+85℃ operating temperature:-40℃~+85℃; Supplier Part: C114953; Manufacturer: Infineon(英飞凌); Supplier Footprint: DFN-6(0.7x1.1); JLCPCB Part Class: Extended Part; Datasheet: https://item.szlcsc.com/datasheet/BGS12SN6E6327XTSA1/116197.html; Supplier: LCSC; isolation: 47dB; Insertion loss: 0.9dB; Frequency range: 50MHz~6GHz; Voltage - Supply: 1.8V~3.5V; operating temperature: -40℃~+85℃
U14 = NX2012SA-32.768KHZ-EXS00A-MU00527: Frequency:32.768kHz Load Capacitance:6pF Frequency Stability:- Frequency Stability:- Equivalent Series Resistance(ESR):80kΩ Operating Temperature:-40℃~+85℃ Operating Temperature:-40℃~+85℃; LCSC Part Name: 32.768kHz 6pF; Supplier Part: C7016235; Manufacturer: NDK; Supplier Footprint: SMD2012-2P; JLCPCB Part Class: Extended Part; Supplier: LCSC; Load Capacitance: 6pF; Equivalent Series Resistance(ESR): 80kΩ; Operating Temperature: -40℃~+85℃
X1 = NX2016SA-32M-EXS00A-CS06465: Frequency:32MHz Load Capacitance:10pF Frequency Stability:- Frequency Stability:- Equivalent Series Resistance(ESR):60Ω Operating Temperature:- Operating Temperature:-; LCSC Part Name: 32MHz 10pF; Supplier Part: C1986260; Manufacturer: NDK; Supplier Footprint: SMD2016-4P; JLCPCB Part Class: Extended Part; Datasheet: https://item.szlcsc.com/datasheet/NX2016SA-32M-EXS00A-CS06465/2077804.html; Supplier: LCSC; Load Capacitance: 10pF; Equivalent Series Resistance(ESR): 60Ω

## Nets
+5V: C1.1 H5.5 P3.6 U4.6(VOUT)
GND: C1.2 C2.2 C3.2 C4.2 C6.2 C7.1 C9.1 C10.1 C13.2 C14.2 C15.1 C16.1 C17.2 C18.2 C19.2 C20.1 C21.1 C22.1 C23.1 C24.1 C25.2 C26.2 C27.2 C28.2 C29.1 C30.2 C31.2 C32.2 C33.2 C34.1 C35.1 C36.2 C37.2 CN1.2 CN2.1 D2.2(A) H1.1 H5.1 H7.1 H7.2 H9.2 JP1.2(GND) JP1.3(GND) P1.2 P2.1 P3.4 R1.1 R2.1 R7.2 R8.2 R9.1 R10.1 R12.2 SW1.3 SW1.4 U3.2(SEL) U3.3(CFG1) U3.4(CFG2) U3.8(GND) U4.2(SEL) U4.3(CFG1) U4.4(CFG2) U4.8(GND) U8.5(GND) U10.48(VSSSMPS) U10.49(EP) U11.B1(GND2) U11.B2(GND3) U11.C2(GND1) U12.4(GND) U13.2(GND) X1.2(GND) X1.4(GND)
VCC: C2.1 C29.2 C30.1 C31.1 C32.1 C33.1 C34.2 C35.2 CN2.2 H1.2 H5.2 H9.1 L3.1 P3.5 R3.2 R4.2 R5.2 R6.2 R11.2 R14.2 SW2.3 SW2.4 U3.6(VOUT) U7.6(PIN6) U10.11(VDD) U10.37(VBAT) U10.44(VDD) U12.3(VDD)
VDDA: C36.1 C37.1 L3.2 U10.41(VDDA)
VDDPA: C20.2 C22.2 C23.2 C24.2 C26.1 C27.1 U10.25(VDDPA) U10.28(VDDRF) U10.46(VDDSMPS)
VDDRF1V55: C21.2 C25.1 C28.1 L2.2 U10.29(VDDRF1V55) U10.45(VFBSMPS)
BOOT: R12.1 SW2.1 SW2.2 U10.19(PH3-BOOT0)
CLK: H7.4 U10.42(PA14)
DIO: H7.3 U10.36(PA13)
EN5V: H8.1 U10.17(PA9)
LED1: LED1.2(-) U7.8(PIN8)
LED2: LED2.2(-) U7.7(PIN7)
LIPOPLUS: C3.1 C4.1 H8.3 U3.1(EN) U3.10(VIN) U4.10(VIN) U8.1(SYS)
PA0: R11.1 U10.7(PA0) U12.5(ALRT#)
PB0: H9.3 U10.30(PB0-VDD_TCXO)
PB3: U7.2(PIN2) U10.1(PB3)
PB4: U7.3(PIN3) U10.2(PB4) U10.13(PA5)
PB5: U7.1(PIN1) U10.3(PB5)
PB6: U10.4(PB6)
PC13: R15.1 U10.38(PC13)
RST: C7.2 C19.1 D2.1(K) H1.5 H7.5 SW1.1 SW1.2 U10.18(NRST)
RX: H1.3 U10.15(PA7)
SCL: CN2.4 H5.4 P3.2 R6.1 U10.35(PA12) U12.7(SCL)
SDA: CN2.3 H5.3 P3.3 R5.1 U10.34(PA11) U12.8(SDA)
SOLARPLUS: D1.2(A) P1.1 P3.1
TX: H1.4 U10.14(PA6)
$1N2497: U3.7(LX2) U6.1
$1N2498: U3.9(LX1) U6.2
$1N2499: U4.9(LX1) U5.2
$1N2500: U4.7(LX2) U5.1
$1N2509: R2.2 U3.5(CFG3)
$1N2510: R1.2 U4.5(CFG3)
$1N2511: H8.2 U4.1(EN)
$1N2534: LED1.1(+) R3.1
$1N2535: LED2.1(+) R4.1
$1N2561: C6.1 CN1.1 P2.2 U8.2(BAT) U12.2(CELL)
$1N2563: R7.1 U8.4(CE#)
$1N2564: D1.1(K) U8.10(IN)
$1N2566: R8.1 U8.6(TS/MR)
$1N2567: R9.2 U8.7(ILIM/VSET)
$1N2569: R10.2 U8.8(ISET)
$1N5916: U10.21(RFI_N) U11.A2(RFI_N_out)
$1N5921: U10.20(RFI_P) U11.A3(RFI_P_out)
$1N5997: C8.1 U11.A1(RFO_in)
$1N6001: C8.2 L1.2 U10.23(RFO_HP)
$1N6167: C9.2 C10.2 L1.1 U10.24(VR_PA)
$1N6399: C11.2 U11.C1(RFO_out)
$1N6407: C11.1 U13.1(RF2)
$1N6414: U11.C3(RFI_in) U13.3(RF1)
$1N6545: C12.2 U13.5(RFIN)
$1N6584: C12.1 R13.1
$1N6623: JP1.1(SIG) R13.2
$1N6744: C13.1 C14.1 R14.1 U13.4(VDD)
$1N7058: C15.2 C16.2 R15.2 U13.6(CTRL)
$1N7436: U10.27(OSC_OUT) X1.3
$1N7448: U10.26(OSC_IN) X1.1
$1N7626: C17.1 U10.40(PC15-OSC32_OUT) U14.2(OSC2)
$1N7632: C18.1 U10.39(PC14-OSC32_IN) U14.1(OSC1)
$1N11363: L2.1 U10.47(VLXSMPS)

Not connected (* = marked no-connect by the designer): CN2 0; H9 4 5; U3 11(EP); U4 11(EP); U7 4(PIN4) 5(PIN5); U8 3(STAT2) 9(STAT1) 11(EP); U10 5(PB7) 6(PB8) 8(PA1) 9(PA2) 10(PA3) 12(PA4) 16(PA8) 22(RFO_LP) 31(PB2) 32(PB12) 33(PA10) 43(PA15); U12 1(CTG) 6(QSTRT) 9(EP)
